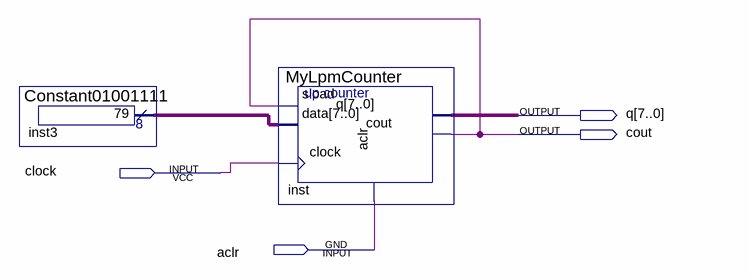
[diagram p0: schematic sheet]
// Quartus schematic FreqDiv177.bdf as structural Verilog: 2 symbols, 4 pins
module FreqDiv177 (
  input  clock,
  input  aclr,
  output [7:0] q,
  output cout
);

  wire [7:0] inst3_result;

  Constant01001111 inst3 (.result(inst3_result));
  MyLpmCounter inst (.sload(cout), .data(inst3_result), .clock(clock), .aclr(aclr), .cout(cout), .q(q));
endmodule
